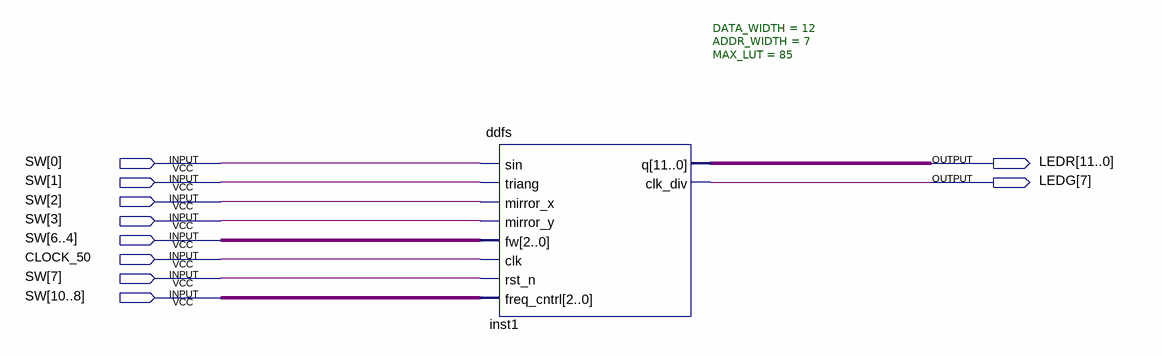
[diagram p0: schematic sheet]
// Quartus schematic funct_gen.bdf as structural Verilog: 1 symbols, 10 pins
module funct_gen (
  input  [10:0] SW,
  input  CLOCK_50,
  output [11:0] LEDR,
  output [7:7] LEDG
);

  ddfs #(.DATA_WIDTH(12), .ADDR_WIDTH(7), .MAX_LUT(85)) inst1 (
    .sin(SW[0]), .triang(SW[1]), .mirror_x(SW[2]), .mirror_y(SW[3]), .fw(SW[6:4]), .clk(CLOCK_50),
    .rst_n(SW[7]), .freq_cntrl(SW[10:8]), .q(LEDR), .clk_div(LEDG[7]));
endmodule
